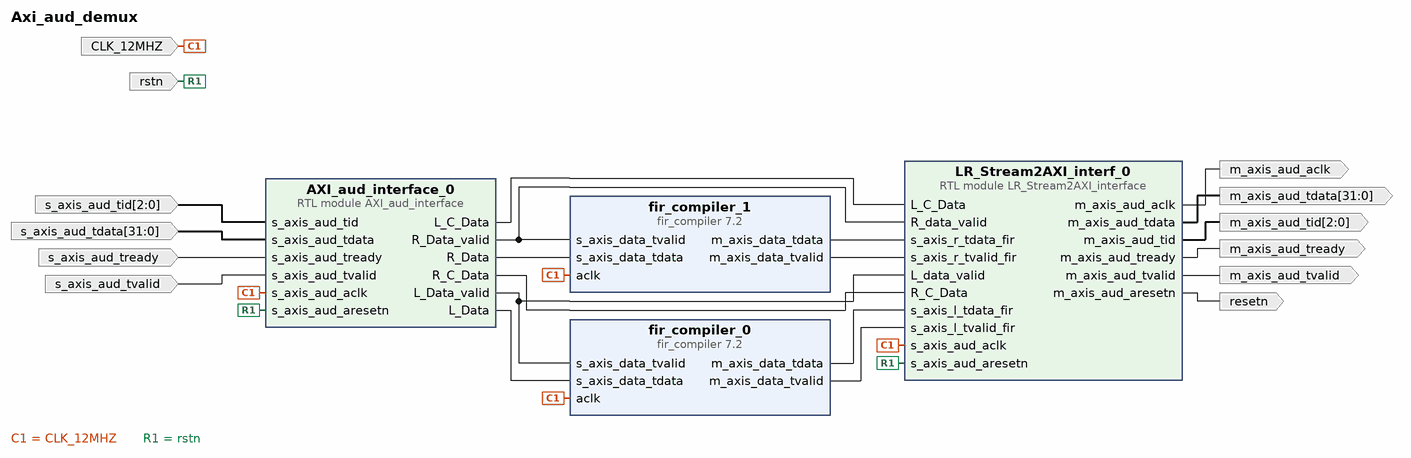
[diagram p0: block diagram of the top level]
# Vivado block design Axi_aud_demux, xc7z020clg400-1, Vivado 2020.2
create_bd_design Axi_aud_demux

create_bd_port -dir I rstn
create_bd_port -dir O -from 31 -to 0 m_axis_aud_tdata
create_bd_port -dir O -from 2 -to 0 m_axis_aud_tid
create_bd_port -dir O m_axis_aud_aclk
create_bd_port -dir O m_axis_aud_tvalid
create_bd_port -dir O m_axis_aud_tready
create_bd_port -dir O resetn
create_bd_port -dir I -from 2 -to 0 s_axis_aud_tid
create_bd_port -dir I -from 31 -to 0 s_axis_aud_tdata
create_bd_port -dir I s_axis_aud_tready
create_bd_port -dir I s_axis_aud_tvalid
create_bd_port -dir I -type clk CLK_12MHZ
set_property -dict {CONFIG.FREQ_HZ 12288000} [get_bd_ports CLK_12MHZ]

create_bd_cell -type module -reference AXI_aud_interface AXI_aud_interface_0
create_bd_cell -type ip -vlnv xilinx.com:ip:fir_compiler:7.2 fir_compiler_0
set_property -dict [list \
  CONFIG.Clock_Frequency 12.288 \
  CONFIG.Coefficient_Structure Inferred \
  CONFIG.Coefficient_Width 16 \
  CONFIG.ColumnConfig 11 \
  CONFIG.Data_Width 24 \
  CONFIG.Filter_Architecture Systolic_Multiply_Accumulate \
  CONFIG.Output_Rounding_Mode Non_Symmetric_Rounding_Down \
  CONFIG.Output_Width 24 \
  CONFIG.Sample_Frequency 12.288 \
] [get_bd_cells fir_compiler_0]
create_bd_cell -type ip -vlnv xilinx.com:ip:fir_compiler:7.2 fir_compiler_1
set_property -dict [list \
  CONFIG.Clock_Frequency 12.288 \
  CONFIG.Coefficient_Structure Inferred \
  CONFIG.Coefficient_Width 16 \
  CONFIG.ColumnConfig 11 \
  CONFIG.Data_Width 24 \
  CONFIG.Filter_Architecture Systolic_Multiply_Accumulate \
  CONFIG.Output_Rounding_Mode Non_Symmetric_Rounding_Down \
  CONFIG.Output_Width 24 \
  CONFIG.Sample_Frequency 12.288 \
] [get_bd_cells fir_compiler_1]
create_bd_cell -type module -reference LR_Stream2AXI_interface LR_Stream2AXI_interf_0

# ---- connections ----

connect_bd_net [get_bd_pins AXI_aud_interface_0/L_C_Data] [get_bd_pins LR_Stream2AXI_interf_0/L_C_Data]
connect_bd_net [get_bd_pins AXI_aud_interface_0/R_C_Data] [get_bd_pins LR_Stream2AXI_interf_0/R_C_Data]
connect_bd_net [get_bd_ports CLK_12MHZ] \
  [get_bd_pins AXI_aud_interface_0/s_axis_aud_aclk] [get_bd_pins fir_compiler_0/aclk] [get_bd_pins fir_compiler_1/aclk] \
  [get_bd_pins LR_Stream2AXI_interf_0/s_axis_aud_aclk]
connect_bd_net [get_bd_ports rstn] [get_bd_pins AXI_aud_interface_0/s_axis_aud_aresetn] [get_bd_pins LR_Stream2AXI_interf_0/s_axis_aud_aresetn]
connect_bd_net [get_bd_pins LR_Stream2AXI_interf_0/m_axis_aud_tdata] [get_bd_ports m_axis_aud_tdata]
connect_bd_net [get_bd_pins LR_Stream2AXI_interf_0/m_axis_aud_tid] [get_bd_ports m_axis_aud_tid]
connect_bd_net [get_bd_pins LR_Stream2AXI_interf_0/m_axis_aud_aclk] [get_bd_ports m_axis_aud_aclk]
connect_bd_net [get_bd_pins LR_Stream2AXI_interf_0/m_axis_aud_tvalid] [get_bd_ports m_axis_aud_tvalid]
connect_bd_net [get_bd_pins LR_Stream2AXI_interf_0/m_axis_aud_tready] [get_bd_ports m_axis_aud_tready]
connect_bd_net [get_bd_pins LR_Stream2AXI_interf_0/m_axis_aud_aresetn] [get_bd_ports resetn]
connect_bd_net [get_bd_ports s_axis_aud_tid] [get_bd_pins AXI_aud_interface_0/s_axis_aud_tid]
connect_bd_net [get_bd_ports s_axis_aud_tdata] [get_bd_pins AXI_aud_interface_0/s_axis_aud_tdata]
connect_bd_net [get_bd_ports s_axis_aud_tready] [get_bd_pins AXI_aud_interface_0/s_axis_aud_tready]
connect_bd_net [get_bd_ports s_axis_aud_tvalid] [get_bd_pins AXI_aud_interface_0/s_axis_aud_tvalid]
connect_bd_net [get_bd_pins AXI_aud_interface_0/R_Data_valid] \
  [get_bd_pins fir_compiler_1/s_axis_data_tvalid] [get_bd_pins LR_Stream2AXI_interf_0/R_data_valid]
connect_bd_net [get_bd_pins AXI_aud_interface_0/L_Data] [get_bd_pins fir_compiler_0/s_axis_data_tdata]
connect_bd_net [get_bd_pins AXI_aud_interface_0/R_Data] [get_bd_pins fir_compiler_1/s_axis_data_tdata]
connect_bd_net [get_bd_pins AXI_aud_interface_0/L_Data_valid] \
  [get_bd_pins fir_compiler_0/s_axis_data_tvalid] [get_bd_pins LR_Stream2AXI_interf_0/L_data_valid]
connect_bd_net [get_bd_pins fir_compiler_1/m_axis_data_tdata] [get_bd_pins LR_Stream2AXI_interf_0/s_axis_r_tdata_fir]
connect_bd_net [get_bd_pins fir_compiler_1/m_axis_data_tvalid] [get_bd_pins LR_Stream2AXI_interf_0/s_axis_r_tvalid_fir]
connect_bd_net [get_bd_pins fir_compiler_0/m_axis_data_tdata] [get_bd_pins LR_Stream2AXI_interf_0/s_axis_l_tdata_fir]
connect_bd_net [get_bd_pins fir_compiler_0/m_axis_data_tvalid] [get_bd_pins LR_Stream2AXI_interf_0/s_axis_l_tvalid_fir]

validate_bd_design
save_bd_design
